# Altium schematic sheet Gps.SchDoc
size A4; SheetNumber: 6; SheetTotal: 6
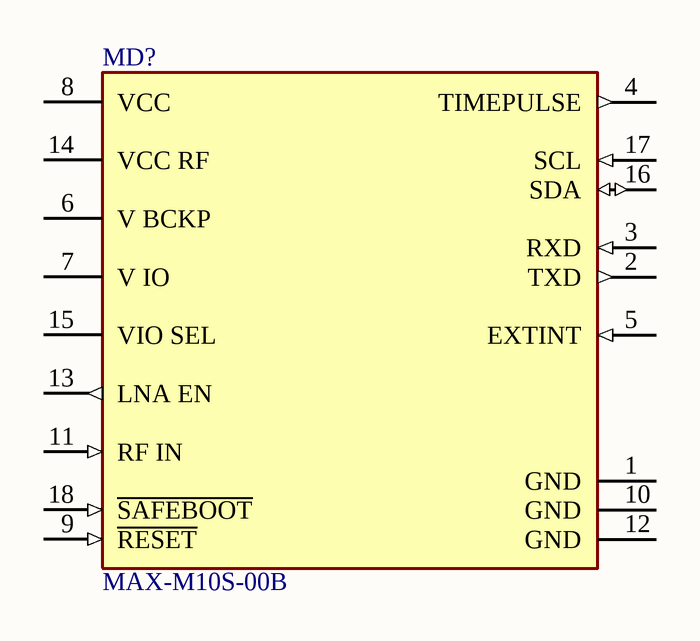
[diagram p0: Gps.SchDoc]

## Parts
MD?  MAX-M10S-00B  [FP-MAX-M10S-00B-MFG]

## Nets

Not connected (* = marked no-connect by the designer): MD? 1(GND) 2(TXD) 3(RXD) 4(TIMEPULSE) 5(EXTINT) 6(V_BCKP) 7(V_IO) 8(VCC) 9(~{RESET}) 10(GND) 11(RF_IN) 12(GND) 13(LNA_EN) 14(VCC_RF) 15(VIO_SEL) 16(SDA) 17(SCL) 18(~{SAFEBOOT})

## Library data of the parts
MD? = CMP-207130-000026-1: GNSS LCC RX, ROM, TCXO, LNA, SAW